# Altium schematic sheet Power.SchDoc: C2Sv1 Power
size A4; SheetNumber: 4; SheetTotal: 5
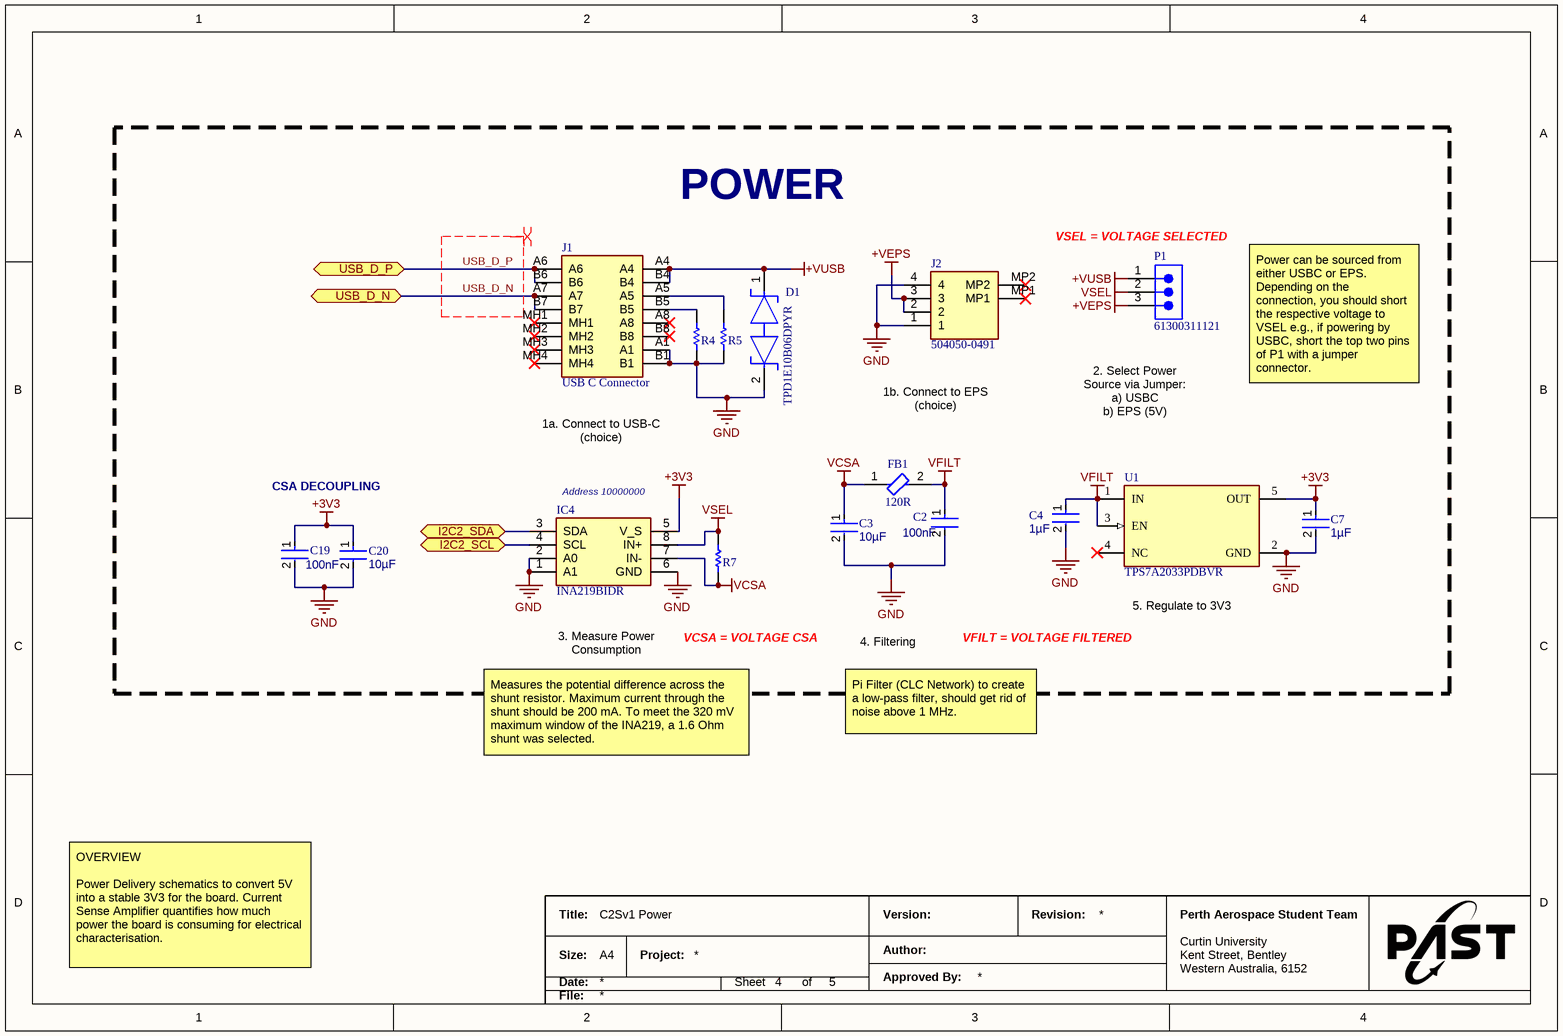
[diagram p0: Power.SchDoc]

## Parts
C2  value 100nF  [FP-GCM188-0_1-IPC_B]  (hidden comment: GCM188L81H104MA57D)
C3  value 10µF  [FP-GCM188-0_2-IPC_B]  (hidden comment: GCM188D70J106ME36D)
C4  value 1µF  [FP-GCM188-0_1-IPC_B]  (hidden comment: GCM188R71C105KA64J)
C7  value 1µF  [FP-GCM188-0_1-IPC_B]  (hidden comment: GCM188R71C105KA64J)
C19  value 100nF  [FP-GCM188-0_1-IPC_B]  (hidden comment: GCM188L81H104MA57D)
C20  value 10µF  [FP-GCM188-0_2-IPC_B]
D1  TPD1E10B06DPYR  [FP-DPY0002A-MFG]
FB1  120R  [FP-BLM18-0_15-t0_6-d1_2-IPC_B]
IC4  INA219BIDR  [SOIC127P600X175-8N]
J1  USB C Connector  [UJ20CHGMSMT2P16TR]
J2  504050-0491  [5040500491]
P1  61300311121  [61300311121]
R4  5.1k  [RESC1608X55N]  (value not drawn)
R5  5.1k  [RESC1608X55N]  (value not drawn)
R7  ERJ-6DQF1R6V  [ERJ6_B_BW_R_LW_CW_D]  (value not drawn)
U1  TPS7A2033PDBVR  [FP-DBV0005A-IPC_B]

## Ports
I2C2_SCL (bidir), I2C2_SDA (bidir), USB_D_N (bidir), USB_D_P (bidir)

## Nets
+3V3: C7.1 C19.1 C20.1 IC4.5(V_S) U1.5(OUT)
+VEPS: J2.2 J2.3 P1.3
+VUSB: D1.1 J1.A4 J1.B4 P1.1
GND: C2.2 C3.2 C4.2 C7.2 C19.2 C20.2 D1.2 IC4.1(A1) IC4.2(A0) IC4.6(GND) J1.A1 J1.B1 J2.1 J2.4 R4.2 R5.2 U1.2(GND)
VCSA: C3.1 FB1.1 IC4.7(IN-) R7.1
VFILT: C2.1 C4.1 FB1.2 U1.1(IN) U1.3(EN)
VSEL: IC4.8(IN+) P1.2 R7.2
I2C2_SCL: IC4.4(SCL) ; port I2C2_SCL
I2C2_SDA: IC4.3(SDA) ; port I2C2_SDA
USB_D_N: J1.A7 J1.B7 ; port USB_D_N
USB_D_P: J1.A6 J1.B6 ; port USB_D_P
NetJ1_A5: J1.A5 R5.1
NetJ1_B5: J1.B5 R4.1

Not connected (* = marked no-connect by the designer): J1 A8* B8* MH1* MH2* MH3* MH4*; J2 MP1* MP2*; U1 4(NC)*

## Layout directives
differential pair: USB_D_N, USB_D_P

## Notes on the sheet
- POWER
- (near P1) VSEL = VOLTAGE SELECTED
- Power can be sourced from either USBC or EPS. Depending on the connection, you should short the respective voltage to VSEL e.g., if powering by USBC, short the top two pins of P1 with a jumper connector.
- 1a. Connect to USB-C (choice)
- 1b. Connect to EPS (choice)
- 2. Select Power Source via Jumper:
  a) USBC
  b) EPS (5V)
- CSA DECOUPLING
- (near IC4) Address 10000000
- 3. Measure Power Consumption
- VCSA = VOLTAGE CSA
- 4. Filtering
- VFILT = VOLTAGE FILTERED
- (near U1) 5. Regulate to 3V3
- Measures the potential difference across the shunt resistor. Maximum current through the shunt should be 200 mA. To meet the 320 mV maximum window of the INA219, a 1.6 Ohm shunt was selected.
- Pi Filter (CLC Network) to create a low-pass filter, should get rid of noise above 1 MHz.
- OVERVIEW
  Power Delivery schematics to convert 5V into a stable 3V3 for the board. Current Sense Amplifier quantifies how much power the board is consuming for electrical characterisation.
- Title:
- Version:
- Revision:
- Perth Aerospace Student Team
- Size:
- Date:
- A4
- Project:
- Sheet
- of
- Author:
- Approved By:
- Curtin University
- Kent Street, Bentley
- Western Australia, 6152
- File:

## Library data of the parts
C2 C19 = CMP-001-00108-1: Cap Ceramic 0.1uF 50V X8L 20% Pad SMD 0603 150C Automotive T/R; Manufacturer Lifecycle Status: IN PRODUCTION; Added By: Felix; Country of Origin: Philippines; Number of Terminals: 2; Max Operating Temperature: 150°C; Tolerance: 20%; Harmonized Tariff Schedule (HTS) Code: 8532.24.00.20; Length: 1.6mm; Thickness: 800µm; Export Control Classification Number (ECCN) Code: EAR99; Voltage Rating (DC): 50V; Mounting Technology: Surface Mount; Dielectric Material: Ceramic; Height: 800µm; Lifecycle Status: Production; Material: Ceramic; Introduction Date: 2013-11-20; Voltage Rating: 50V; Width: 800µm; RoHS: Compliant; REACH SVHC: Yes; Min Operating Temperature: -55°C; Case/Package: 0603
C3 C20 = CMP-001-00109-1: 6.3V 10uF X7T ±20% 0603 Multilayer Ceramic Capacitors MLCC - SMD/SMT ROHS; Manufacturer Lifecycle Status: IN PRODUCTION; Added By: Felix; Thickness: 800µm; REACH SVHC: Yes; Voltage Rating (DC): 6.3V; Number of Terminals: 2; Dielectric Material: Ceramic; Lifecycle Status: Production; Harmonized Tariff Schedule (HTS) Code: 8532.24.00.20; Case/Package: 0603; Introduction Date: 2020-01-27; Schedule B: 8532240020; Mounting Technology: Surface Mount; Voltage Rating: 6.3V; Export Control Classification Number (ECCN) Code: EAR99; Min Operating Temperature: -55°C; RoHS: Compliant; Material: Ceramic; Width: 800µm; Max Operating Temperature: 125°C; Height: 800µm; Length: 1.6mm; Tolerance: 20%
C4 C7 = CMP-001-00107-1: 16V 1uF X7R ±10% 0603 Multilayer Ceramic Capacitors MLCC - SMD/SMT ROHS; Manufacturer Lifecycle Status: IN PRODUCTION; Added By: Felix; Tolerance: 10%; Max Operating Temperature: 125°C; Case Code (Imperial): 0603; Height: 800µm; Export Control Classification Number (ECCN) Code: EAR99; Voltage Rating (DC): 16V; Depth: 800µm; Case/Package: 0603; Case Code (Metric): 1608; Ratings: AEC-Q200; Mounting Technology: Surface Mount; Lifecycle Status: Production; RoHS: Compliant; Length: 1.6mm; Introduction Date: 2010-10-29; Radiation Hardening: No; Min Operating Temperature: -55°C; Packaging: Tape & Reel (TR); Lead Free: Lead Free; Voltage Rating: 16V; Material: Ceramic; Country of Origin: Philippines; Dielectric Material: Ceramic; REACH SVHC: Yes; Width: 800µm; Harmonized Tariff Schedule (HTS) Code: 8532.24.00.20; Number of Terminals: 2; Schedule B: 8532240020, 8532240020; Dielectric: X7R
D1 = CMP-0326-00004-4: TVS DIODE 5.5V 14V 2X1SON; Leakage Current: 100nA; Min Breakdown Voltage: 6V; Number of Channels: 1; ESD Protection: Yes; Power Line Protection: No; Test Current: 1mA; Interface: GPIO; Element Configuration: Single; Peak Pulse Current: 5A; Direction: Bidirectional; Peak Pulse Power: 90W; Capacitance: 12pF; Composition: Zener; Packaging: Tape and Reel; Number of Pins: 2; Breakdown Voltage: 6V; Radiation Hardening: No; Min Operating Temperature: -40°C; Contact Plating: Gold; Lead Free: Lead Free; Height: 0.35mm; REACH SVHC: No SVHC; Case/Package: 0402; Max Operating Temperature: 125°C; Width: 0.7mm; Clamping Voltage: 14V; Package Quantity: 1; Max Reverse Leakage Current: 100nA; Working Voltage: 5.5V; Length: 1.1mm; Number of Bidirectional Channels: 1; Reverse Standoff Voltage: 5.5V
FB1 = CMP-06046-002016-1: Chip Ferrite Bead Array, 0603, 120Ω @ 100MHz, 25%, 0.03Ω, 3A; DC Resistance (DCR): 30mR; Number of Lines: 1; Case/Package: 0603; Packaging: Tape and Reel; Case Code (Metric): 1608; Ratings: AEC-Q200; Max Operating Temperature: 125°C; Mount: Surface Mount; RoHS Compliant: Yes; Min Operating Temperature: -55°C; Max Current Rating: 3A; Case Code (Imperial): 0603
IC4 = CMP-033-000101-2: Integrated Circuit; Manufacturer_Name: Texas Instruments; Mouser Price/Stock: https://mou.sr/4bbpsfM; Design Item ID: INA219BIDR; Manufacturer_Part_Number: INA219BIDR; Datasheet Link: https://www.ti.com/lit/ds/symlink/ina219.pdf?HQS=TI-null-null-digikeymode-df-pf-null-wwe&ts=1601223553719; Author: Damon Stewart; Mouser Part Number: 595-INA219BIDR; Height: 1.75mm
J1 = CMP-026-000123-2: UJ20-C-H-G-MSMT-2-P16-TR Connector; Manufacturer_Name: Same Sky; Source: SamacSys.SchLib; Mouser Part Number: 179-UJ20CHGMSMT2P16T; Height: 3.36mm; Datasheet Link: https://cz.mouser.com/ProductDetail/Same-Sky/UJ20-C-H-G-MSMT-2-P16-TR?qs=IKkN%2F947nfBldcIwp9d6BA%3D%3D; Manufacturer_Part_Number: UJ20-C-H-G-MSMT-2-P16-TR; Mouser Price/Stock: https://www.mouser.co.uk/ProductDetail/Same-Sky/UJ20-C-H-G-MSMT-2-P16-TR?qs=IKkN%2F947nfBldcIwp9d6BA%3D%3D; Design Item ID: UJ20-C-H-G-MSMT-2-P16-TR; Author: Raphael Ho
J2 = CMP-026-000012-2: Connector; Manufacturer_Name: Molex; Manufacturer_Part_Number: 504050-0491; Design Item ID: 504050-0491; Mouser Price/Stock: https://www.mouser.co.uk/ProductDetail/Molex/504050-0491?qs=yXHQdf%252Bjwlut3yyE1%252ByhMA%3D%3D; Source: SamacSys.SchLib; Datasheet Link: http://www.molex.com/pdm_docs/sd/5040500491_sd.pdf; Mouser Part Number: 538-504050-0491; Height: 2.15mm
P1 = CMP-096-000137-1: WR-PHD Pin Header, THT, Vertical, pitch 2.54mm, 1 Row, 3P; Manufacturer: Wurth Elektronik; Contact Resistance: 20mOhm; Rated Current: 3A; Withstanding Voltage: 500V; Working Voltage: 250V; Operating Temperature Max: 105°C; Manufacturer Part Number: 61300311121; Match Code: WR-PHD; ComponentLink2Description: Datasheet Link; ComponentLink1Description: Website Link; Number of Pins: 3; Orientation: Vertical; Mount: Through Hole; Gender: Pin Header; Pin Count: 3; ComponentLink2URL: https://www.we-online.com/redexpert/spec/61300311121?ad; Pitch: 2.54mm; Packaging: Bag; Operating Temperature Min: -40°C; ComponentLink1URL: https://www.we-online.com/redexpert/article/61300311121?ad; Component Type: Standard; Design Item ID: 61300311121; Source: WR-PHD.SchLib; Category: Board-to-Board Connectors; Number of Rows: 1
R4 R5 = CMP-057-000007-2: AC0603FR-7W5K1L Resistor; Manufacturer_Name: YAGEO; Datasheet Link: https://www.yageo.com/upload/media/product/productsearch/datasheet/rchip/PYu-AC_51_RoHS_L_10.pdf; Height: 0.55mm; Design Item ID: AC0603FR-7W5K1L; Author: Raphael Ho; Manufacturer_Part_Number: AC0603FR-7W5K1L
R7 = CMP-238-000000-2: SMD Current Sense Resistor; Manufacturer_Name: Panasonic; Added By: Felix; Manufacturer_Part_Number: ERJ-6DQF1R6V; Mouser Price/Stock: https://www.mouser.com/Search/Refine.aspx?Keyword=667-ERJ-6DQF1R6V; Source: Schlib1.SchLib; Design Item ID: ERJ-6DQF1R6V; Mouser Part Number: 667-ERJ-6DQF1R6V; Datasheet Link: http://industrial.panasonic.com/cdbs/www-data/pdf/RDN0000/AOA0000C313.pdf
U1 = CMP-019-00056-1: 300mA ultra-low-noise low-IQ low-dropout (LDO) linear regulator with high PSRR 5-SOT-23 -40 to 125; Manufacturer Lifecycle Status: ACTIVE; Min Supply Voltage: 1.6V; Number of Outputs: 1; Added By: Felix Abbott; Output Voltage: 3.3V; Max Supply Voltage: 6V; Max Junction Temperature (Tj): 125°C; Dropout Voltage: 145mV; Nominal Supply Current: 6.5µA; Accuracy: 1.5%; Width: 1.6mm; Pins: 5; Height: 1.45mm; Thickness: 1.2mm; Max Operating Temperature: 125°C; RoHS: Compliant; Case/Package: SOT-23; Number of Channels: 1; Lifecycle Status: Production; Length: 2.9mm; Min Operating Temperature: -40°C; Output Current: 300mA